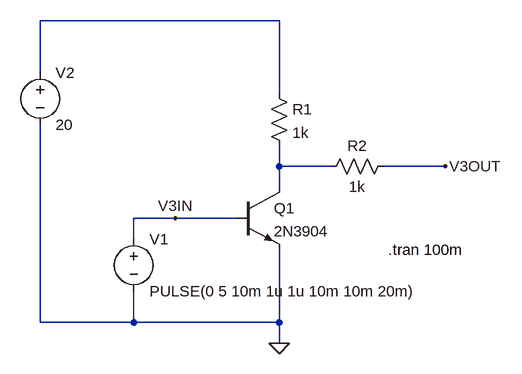
[diagram p0: schematic Test_Transistor_Inverter.asc]
Test_Transistor_Inverter.asc, the LTspice schematic file:
Version 4
SHEET 1 880 680
WIRE 272 -80 -96 -80
WIRE -96 0 -96 -80
WIRE 272 32 272 -80
WIRE 272 144 272 112
WIRE 352 144 272 144
WIRE 528 144 432 144
WIRE 272 176 272 144
WIRE 112 224 48 224
WIRE 208 224 112 224
WIRE 48 256 48 224
WIRE -96 384 -96 80
WIRE 48 384 48 336
WIRE 48 384 -96 384
WIRE 272 384 272 272
WIRE 272 384 48 384
WIRE 272 416 272 384
FLAG 272 416 0
FLAG 528 144 V3OUT
FLAG 112 224 V3IN
SYMBOL npn 208 176 R0
SYMATTR InstName Q1
SYMATTR Value 2N3904
SYMBOL res 256 16 R0
SYMATTR InstName R1
SYMATTR Value 1k
SYMBOL voltage 48 240 R0
WINDOW 123 0 0 Left 0
WINDOW 39 0 0 Left 0
SYMATTR InstName V1
SYMATTR Value PULSE(0 5 10m 1u 1u 10m 10m 20m)
SYMBOL voltage -96 -16 R0
WINDOW 123 0 0 Left 0
WINDOW 39 0 0 Left 0
SYMATTR InstName V2
SYMATTR Value 20
SYMBOL res 448 128 R90
WINDOW 0 0 56 VBottom 2
WINDOW 3 32 56 VTop 2
SYMATTR InstName R2
SYMATTR Value 1k
TEXT 440 272 Left 2 !.tran 100m

The netlist it stands for:
* Test_Transistor_Inverter.asc
Q1 N002 V3IN 0 0 2N3904
R1 N001 N002 1k
V1 V3IN 0 PULSE(0 5 10m 1u 1u 10m 10m 20m)
V2 N001 0 20
R2 V3OUT N002 1k
.model NPN NPN
.model PNP PNP
.lib standard.bjt
.tran 100m
.backanno
.end